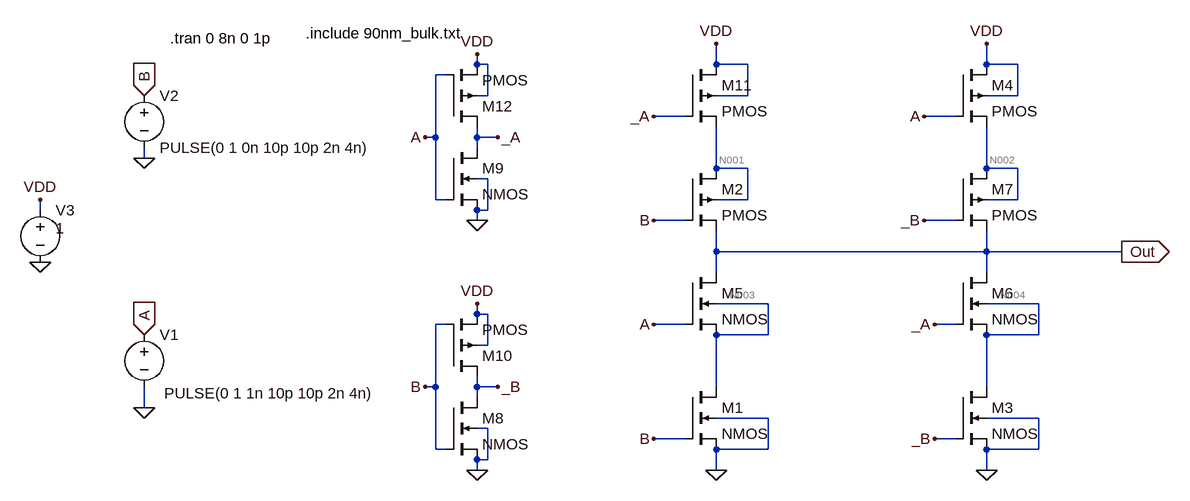
[diagram p0: schematic Draf2.asc]
Draf2.asc, the LTspice schematic file:
Version 4
SHEET 1 1148 1812
WIRE -512 352 -512 336
WIRE -496 352 -512 352
WIRE -144 352 -144 320
WIRE -96 352 -144 352
WIRE 272 352 272 320
WIRE 320 352 272 352
WIRE -560 368 -576 368
WIRE -496 400 -496 352
WIRE -496 400 -512 400
WIRE -96 400 -96 352
WIRE -96 400 -144 400
WIRE 320 400 320 352
WIRE 320 400 272 400
WIRE -192 432 -240 432
WIRE 224 432 176 432
WIRE -576 464 -576 368
WIRE -576 464 -592 464
WIRE -512 464 -512 448
WIRE -480 464 -512 464
WIRE -512 480 -512 464
WIRE -1024 496 -1024 480
WIRE -144 512 -144 448
WIRE -96 512 -144 512
WIRE 272 512 272 448
WIRE 320 512 272 512
WIRE -496 528 -512 528
WIRE -576 560 -576 464
WIRE -560 560 -576 560
WIRE -96 560 -96 512
WIRE -96 560 -144 560
WIRE 320 560 320 512
WIRE 320 560 272 560
WIRE -1184 576 -1184 560
WIRE -496 576 -496 528
WIRE -496 576 -512 576
WIRE -512 592 -512 576
WIRE -192 592 -240 592
WIRE 224 592 176 592
WIRE -144 640 -144 608
WIRE 272 640 272 608
WIRE 272 640 -144 640
WIRE 480 640 272 640
WIRE -144 672 -144 640
WIRE 272 672 272 640
WIRE -64 720 -144 720
WIRE 352 720 272 720
WIRE -512 736 -512 720
WIRE -496 736 -512 736
WIRE -560 752 -576 752
WIRE -192 752 -240 752
WIRE 224 752 192 752
WIRE -64 768 -64 720
WIRE -64 768 -144 768
WIRE 352 768 352 720
WIRE 352 768 272 768
WIRE -496 784 -496 736
WIRE -496 784 -512 784
WIRE -576 848 -576 752
WIRE -576 848 -592 848
WIRE -512 848 -512 832
WIRE -480 848 -512 848
WIRE -144 848 -144 768
WIRE 272 848 272 768
WIRE -512 864 -512 848
WIRE -1024 880 -1024 848
WIRE -64 896 -144 896
WIRE 352 896 272 896
WIRE -496 912 -512 912
WIRE -192 928 -240 928
WIRE 224 928 192 928
WIRE -576 944 -576 848
WIRE -560 944 -576 944
WIRE -64 944 -64 896
WIRE -64 944 -144 944
WIRE 352 944 352 896
WIRE 352 944 272 944
WIRE -496 960 -496 912
WIRE -496 960 -512 960
WIRE -512 976 -512 960
WIRE -144 976 -144 944
WIRE 272 976 272 944
FLAG -1024 880 0
FLAG -1024 496 0
FLAG -1184 560 VDD
FLAG -1184 656 0
FLAG -144 320 VDD
FLAG -1024 768 A
IOPIN -1024 768 In
FLAG -1024 400 B
IOPIN -1024 400 In
FLAG 272 320 VDD
FLAG -240 432 _A
FLAG 176 432 A
FLAG -240 752 A
FLAG -240 592 B
FLAG 176 592 _B
FLAG 192 752 _A
FLAG -240 928 B
FLAG 192 928 _B
FLAG -144 976 0
FLAG 272 976 0
FLAG 480 640 Out
IOPIN 480 640 Out
FLAG -512 976 0
FLAG -512 720 VDD
FLAG -480 848 _B
FLAG -592 848 B
FLAG -512 592 0
FLAG -512 336 VDD
FLAG -480 464 _A
FLAG -592 464 A
SYMBOL voltage -1024 752 R0
WINDOW 3 31 106 Left 2
WINDOW 123 0 0 Left 2
WINDOW 39 0 0 Left 2
SYMATTR Value PULSE(0 1 1n 10p 10p 2n 4n)
SYMATTR InstName V1
SYMBOL voltage -1024 384 R0
WINDOW 123 0 0 Left 2
WINDOW 39 0 0 Left 2
SYMATTR InstName V2
SYMATTR Value PULSE(0 1 0n 10p 10p 2n 4n)
SYMBOL voltage -1184 560 R0
WINDOW 123 0 0 Left 2
WINDOW 39 0 0 Left 2
WINDOW 3 24 44 Left 2
SYMATTR Value 1
SYMATTR InstName V3
SYMBOL pmos4 -192 352 R0
SYMATTR InstName M11
SYMATTR Value2 l=90n w=400n
SYMBOL pmos4 -192 512 R0
SYMATTR InstName M2
SYMATTR Value2 l=90n w=400n
SYMBOL nmos4 -192 672 R0
SYMATTR InstName M5
SYMATTR Value2 l=90n w=200n
SYMBOL nmos4 -192 848 R0
SYMATTR InstName M1
SYMATTR Value2 l=90n w=200n
SYMBOL nmos4 224 848 R0
SYMATTR InstName M3
SYMATTR Value2 l=90n w=200n
SYMBOL nmos4 224 672 R0
SYMATTR InstName M6
SYMATTR Value2 l=90n w=200n
SYMBOL pmos4 224 512 R0
SYMATTR InstName M7
SYMATTR Value2 l=90n w=400n
SYMBOL pmos4 224 352 R0
SYMATTR InstName M4
SYMATTR Value2 l=90n w=400n
SYMBOL nmos4 -560 864 R0
SYMATTR InstName M8
SYMATTR Value2 l=90n w=200n
SYMBOL pmos4 -560 832 M180
SYMATTR InstName M10
SYMBOL nmos4 -560 480 R0
SYMATTR InstName M9
SYMATTR Value2 l=90n w=200n
SYMBOL pmos4 -560 448 M180
SYMATTR InstName M12
TEXT -984 312 Left 2 !.tran 0 8n 0 1p
TEXT -776 304 Left 2 !.include 90nm_bulk.txt

The netlist it stands for:
* Draf2.asc
V1 A 0 PULSE(0 1 1n 10p 10p 2n 4n)
V2 B 0 PULSE(0 1 0n 10p 10p 2n 4n)
V3 VDD 0 1
M11 VDD _A N001 VDD PMOS l=90n w=400n
M2 N001 B Out N001 PMOS l=90n w=400n
M5 Out A N003 N003 NMOS l=90n w=200n
M1 N003 B 0 0 NMOS l=90n w=200n
M3 N004 _B 0 0 NMOS l=90n w=200n
M6 Out _A N004 N004 NMOS l=90n w=200n
M7 N002 _B Out N002 PMOS l=90n w=400n
M4 VDD A N002 VDD PMOS l=90n w=400n
M8 _B B 0 0 NMOS l=90n w=200n
M10 _B B VDD VDD PMOS
M9 _A A 0 0 NMOS l=90n w=200n
M12 _A A VDD VDD PMOS
.model NMOS NMOS
.model PMOS PMOS
.lib standard.mos
.tran 0 8n 0 1p
.include 90nm_bulk.txt
.backanno
.end

* Results of the author's LTspice run, read from the files saved beside the schematic
* Operating Point, zero values left out:
*   V(vdd) = 1 V
*   V(_a) = 999.9 mV
*   V(n001) = 98.98 mV
*   V(out) = 39.63 µV
*   V(n003) = 19.81 µV
*   V(n004) = 20.22 µV
*   V(_b) = 999.9 mV
*   V(n002) = 1 V
*   Id(M9) = 5.236 nA
*   Ig(M9) = -127.9 pA
*   Ib(M9) = -1.01 pA
*   Is(M9) = -5.107 nA
*   Id(M8) = 5.236 nA
*   Ig(M8) = -127.9 pA
*   Ib(M8) = -1.01 pA
*   Is(M8) = -5.107 nA
*   Id(M6) = 12.91 nA
*   Ig(M6) = 547.9 pA
*   Is(M6) = -13.46 nA
*   Id(M3) = 13.46 nA
*   Ig(M3) = 548 pA
*   Is(M3) = -14.01 nA
*   Id(M12) = -5.784 nA
*   Ig(M12) = -85.41 pA
*   Ib(M12) = 48.36 pA
*   Is(M12) = 5.821 nA
*   Id(M10) = -5.785 nA
*   Ig(M10) = -85.41 pA
*   Ib(M10) = 48.36 pA
*   Is(M10) = 5.822 nA
*   Id(M4) = 7.453 nA
*   Ig(M4) = -2.923 pA
*   Is(M4) = -7.45 nA
*   Id(M7) = 7.449 nA
*   Ig(M7) = 1.447 pA
*   Ib(M7) = 1 pA
*   Is(M7) = -7.452 nA
*   Id(M2) = 5.462 nA
*   Is(M2) = -5.462 nA
*   Id(M11) = 5.46 nA
*   Is(M11) = -5.462 nA
*   I(V3) = -24.65 nA
*   I(V2) = 213.3 pA
*   I(V1) = 216.2 pA
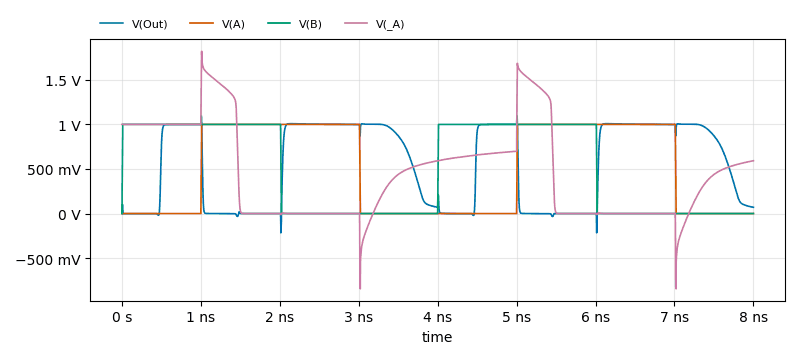
[diagram p1: Transient Analysis of Draf2.asc, plotted from the saved traces]
* Transient Analysis, 1 run:
*   V(Out): min -217 mV, max 1.096 V, average 546.4 mV, rms 721.9 mV, last 70.04 mV
*   V(A): min 0 V, max 1 V, average 502.5 mV, rms 708.3 mV, last 0 V
*   V(B): min 0 V, max 1 V, average 502.5 mV, rms 708.3 mV, last 0 V
*   V(_A): min -844.9 mV, max 1.821 V, average 453.3 mV, rms 683.6 mV, last 592.3 mV